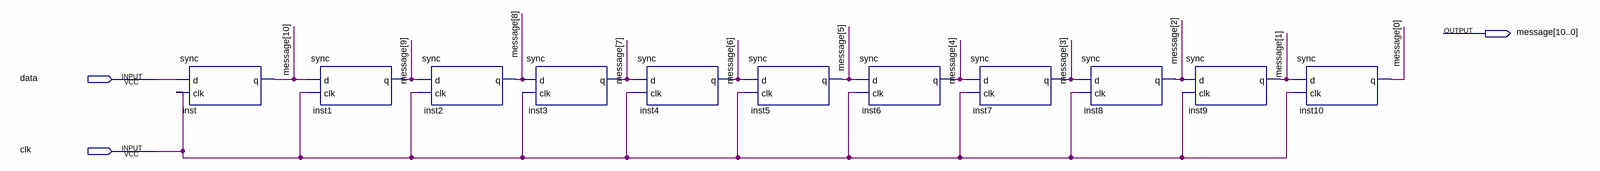
[diagram p0: schematic sheet]
// Quartus schematic data_received.bdf as structural Verilog: 11 symbols, 3 pins
module data_received (
  input  data,
  input  clk,
  output [10:0] message
);

  sync inst (.d(data), .clk(clk), .q(message[10]));
  sync inst1 (.d(message[10]), .clk(clk), .q(message[9]));
  sync inst2 (.d(message[9]), .clk(clk), .q(message[8]));
  sync inst3 (.d(message[8]), .clk(clk), .q(message[7]));
  sync inst4 (.d(message[7]), .clk(clk), .q(message[6]));
  sync inst5 (.d(message[6]), .clk(clk), .q(message[5]));
  sync inst6 (.d(message[5]), .clk(clk), .q(message[4]));
  sync inst7 (.d(message[4]), .clk(clk), .q(message[3]));
  sync inst8 (.d(message[3]), .clk(clk), .q(message[2]));
  sync inst9 (.d(message[2]), .clk(clk), .q(message[1]));
  sync inst10 (.d(message[1]), .clk(clk), .q(message[0]));
endmodule
